# EasyEDA schematic SCH_Mini Fridge Hat_2022-05-06.json
TITLE: Carboy Cooler; REV: 1.0; Date: 2022-05-02; Sheet: 1/1
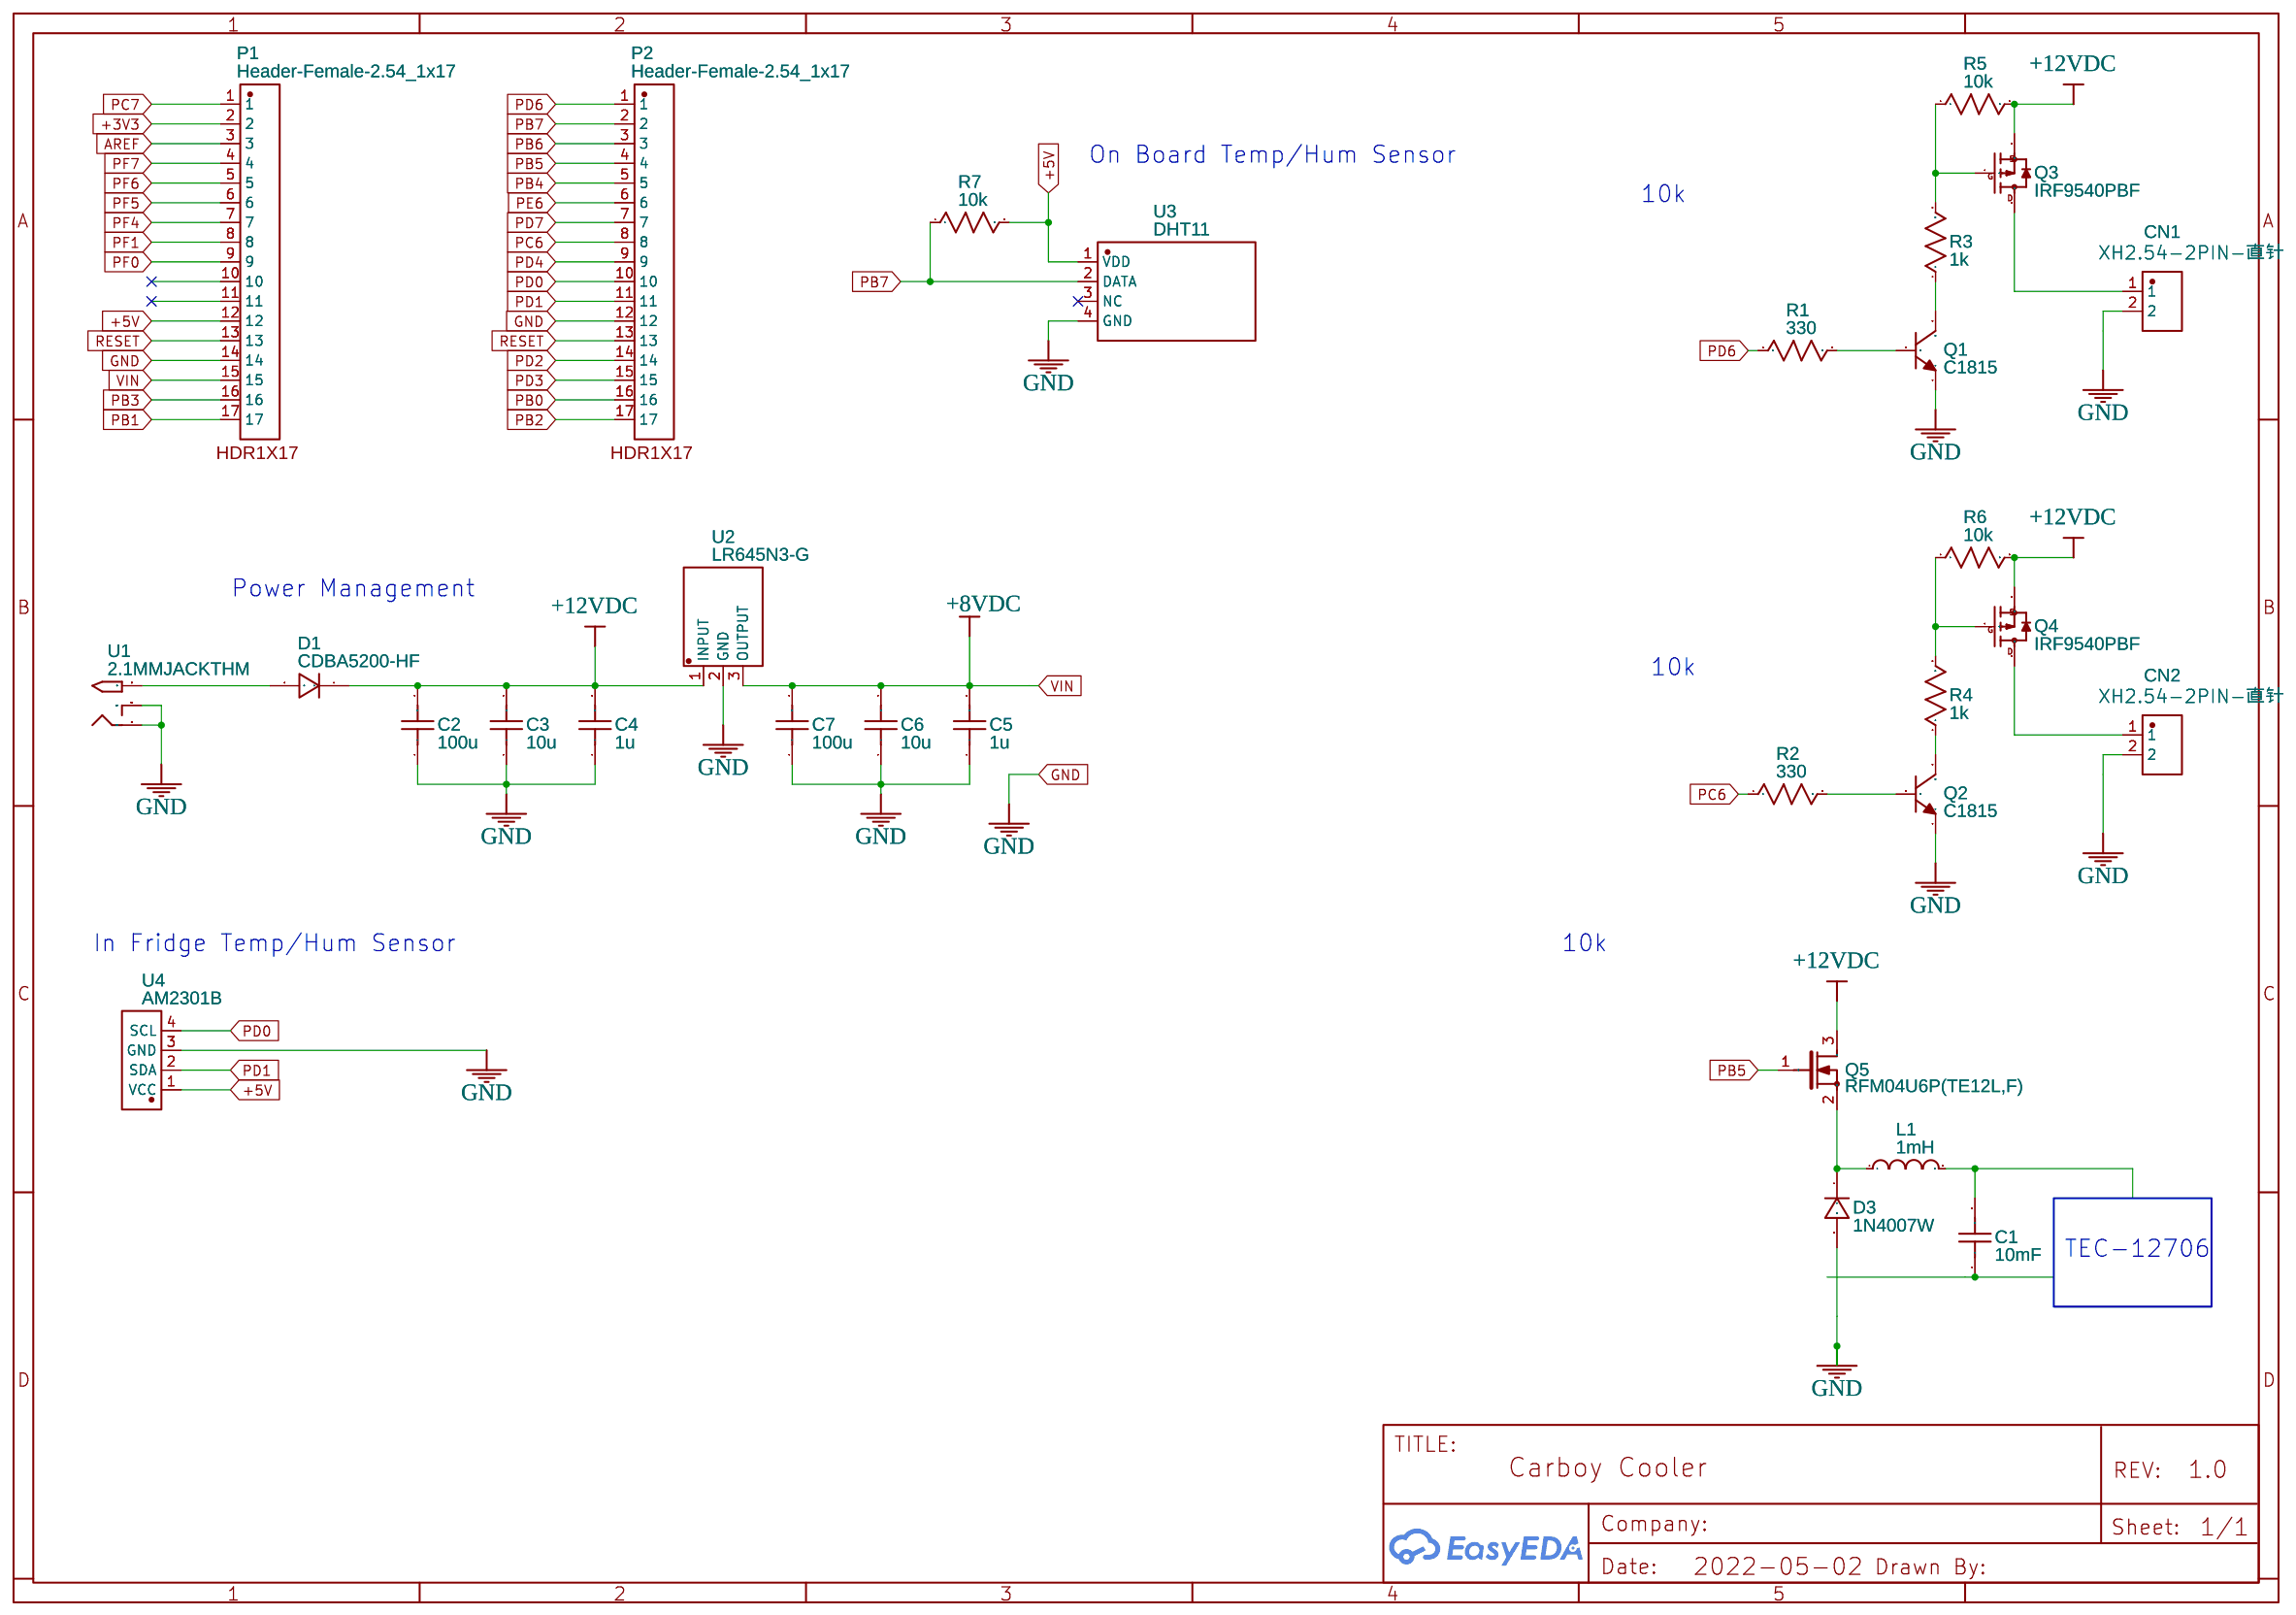
[diagram p0: schematic sheet]

## Parts
C1  10mF  [C0805]
C2  100u  [C0805]
C3  10u  [C0805]
C4  1u  [C0805]
C5  1u  [C0805]
C6  10u  [C0805]
C7  100u  [C0805]
CN1  XH2.54-2PIN-直针  [CONN-TH_XH2.54-2P]
CN2  XH2.54-2PIN-直针  [CONN-TH_XH2.54-2P]
D1  CDBA5200-HF  [SOD-123_L2.8-W1.8-LS3.7-RD]
D3  1N4007W  [SOD-123_L2.8-W1.8-LS3.7-RD]
L1  1mH  [L0603]
P1  Header-Female-2.54_1x17  [HDR1X17]
P2  Header-Female-2.54_1x17  [HDR1X17]
Q1  C1815  [TO-92-3_L4.9-W3.7-P1.27-L]
Q2  C1815  [TO-92-3_L4.9-W3.7-P1.27-L]
Q3  IRF9540PBF  [TO-220-3_L10.0-W4.5-P2.54-L]
Q4  IRF9540PBF  [TO-220-3_L10.0-W4.5-P2.54-L]
Q5  RFM04U6P(TE12L,F)  [SC-62-3_L4.6-W2.5-P1.50-LS4.2-BR]
R1  330  [R0805]
R2  330  [R0805]
R3  1k  [R0805]
R4  1k  [R0805]
R5  10k  [R0805]
R6  10k  [R0805]
R7  10k  [R0805]
U1  2.1MMJACKTHM  [DC-IN-TH_PJ-002AH]
U2  LR645N3-G  [TO-92-3_L4.9-W3.7-P1.27-L]
U3  DHT11  [SENSOR-TH_DHT11]
U4  AM2301B

## Library data of the parts
C1-C7 = C_0805_US: Contributor: LCEDA_Lib
CN1 CN2 = XH2.54-2PIN-直针: Supplier: LCSC; Supplier Part: C9900011425; Manufacturer: null; Contributor: LCSC; JLCPCB Part Class: Extended Part
D1 = 1N4007W: Supplier: Digi-Key; Supplier Part: 641-1706-1-ND; Contributor: LCEDA_Lib
D3 = 1N4007W: Supplier: LCSC; Supplier Part: C328592; Manufacturer: BLUE ROCKET; Contributor: LCEDA_Lib
L1 = L0603_US: Contributor: LCEDA_Lib
P1 P2 = 17 Pin Header: Package Display: Yes; Supplier: Digi-Key
Q1 Q2 = C1815: Supplier: LCSC; Manufacturer: CJ; Supplier Part: C57616; JLCPCB Part Class: Extended Part
Q3 Q4 = IRF9540PBF: Supplier: LCSC; Manufacturer: VISHAY; Contributor: LCSC; Supplier Part: C183014; JLCPCB Part Class: Extended Part
Q5 = RFM04U6P(TE12L,F): Supplier: LCSC; Supplier Part: C194959; Manufacturer: TOSHIBA; Contributor: LCSC; JLCPCB Part Class: Extended Part
R1-R7 = R_0805_US: Contributor: LCEDA_Lib
U1 = 2.1MMJACKTHM: 2.1mm x 5.5mm THM DC jack with internal switch. Digikey part #PJ-102A, 4UCON part #05537; Contributor: Adafruit; Supplier: Digi-Key; Supplier Part: PJ-002AH; Manufacturer: CUI Devices
U2 = LR645N3-G: Supplier: LCSC; Supplier Part: C184943; Manufacturer: Microchip Tech; Contributor: LCSC; JLCPCB Part Class: Extended Part
U3 = DHT11: Supplier: LCSC; Supplier Part: C117051; Manufacturer: Aosong (Guangzhou) Elec; Contributor: LCSC; JLCPCB Part Class: Extended Part
U4 = AM2301B: Supplier: Asair

## Nets
+3V3: P1.2
+5V: P1.12 R7.2 U3.1(VDD) U4.1(VCC)
+8VDC: C5.2 C6.2 C7.2 P1.15 U2.3(OUTPUT)
+12VDC: C2.2 C3.2 C4.2 D1.1 Q3.3(S) Q4.3(S) Q5.3(D) R5.2 R6.2 U2.1(INPUT)
GND: C2.1 C3.1 C4.1 C5.1 C6.1 C7.1 CN1.2 CN2.2 D3.2 P1.14 P2.12 Q1.1(E) Q2.1(E) U1.RING U1.RING_SW U2.2(GND) U3.4(GND) U4.3(GND)
AREF: P1.3
PB0: P2.16
PB1: P1.17
PB2: P2.17
PB3: P1.16
PB4: P2.5
PB5: P2.4 Q5.1(G)
PB6: P2.3
PB7: P2.2 R7.1 U3.2(DATA)
PC6: P2.8 R2.1
PC7: P1.1
PD0: P2.10 U4.4(SCL)
PD1: P2.11 U4.2(SDA)
PD2: P2.14
PD3: P2.15
PD4: P2.9
PD6: P2.1 R1.1
PD7: P2.7
PE6: P2.6
PF0: P1.9
PF1: P1.8
PF4: P1.7
PF5: P1.6
PF6: P1.5
PF7: P1.4
RESET: P1.13 P2.13
Net-(C1-2): C1.2 L1.2
Net-(CN1-1): CN1.1 Q3.2(D)
Net-(CN2-1): CN2.1 Q4.2(D)
Net-(D1-2): D1.2 U1.TIP
Net-(D3-1): D3.1 L1.1 Q5.2(S)
Net-(Q1-2): Q1.2(C) R3.1
Net-(Q1-3): Q1.3(B) R1.2
Net-(Q2-2): Q2.2(C) R4.1
Net-(Q2-3): Q2.3(B) R2.2
Net-(Q3-1): Q3.1(G) R3.2 R5.1
Net-(Q4-1): Q4.1(G) R4.2 R6.1

Not connected (* = marked no-connect by the designer): C1 1; P1 10 11; U3 3(NC)*

## Notes on the sheet
- On Board Temp/Hum Sensor
- 10k
- Power Management
- 10k
- In Fridge Temp/Hum Sensor
- 10k
- TEC-12706
